# Altium schematic sheet H-00488 - I2C Address.SchDoc: I2C Address Selection
size 403 x 281 mm; DocumentNumber: 4; SheetNumber: 4; SheetTotal: 12
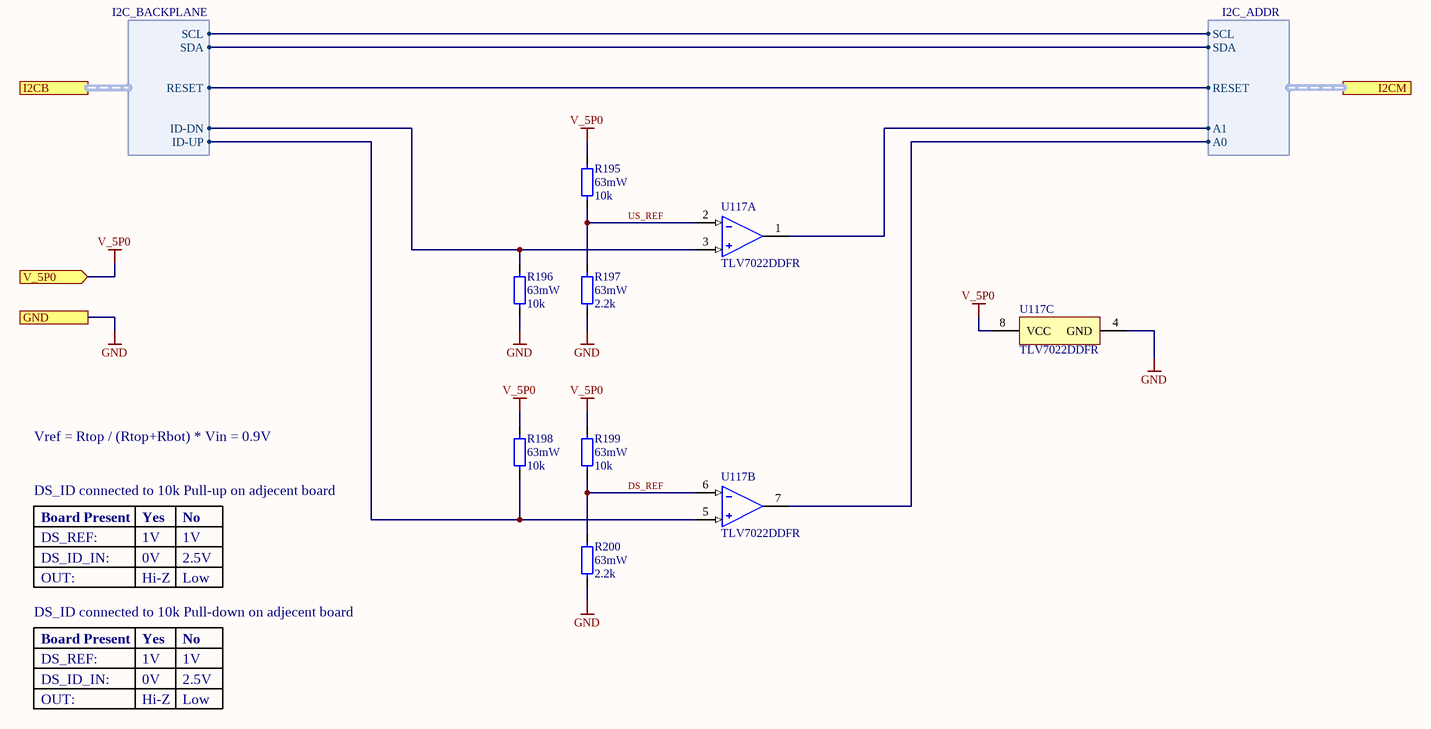
[diagram p0: H-00488 - I2C Address.SchDoc]

## Parts
R195  value 10k  Rated Power: 63mW  [RESC100X50X40L25N]  (hidden comment: CRCW040210K0FKED)
R196  value 10k  Rated Power: 63mW  [RESC100X50X40L25N]  (hidden comment: CRCW040210K0FKED)
R197  value 2.2k  Rated Power: 63mW  [RESC100X50X40L25N]  (hidden comment: CRCW04022K20FKED)
R198  value 10k  Rated Power: 63mW  [RESC100X50X40L25N]  (hidden comment: CRCW040210K0FKED)
R199  value 10k  Rated Power: 63mW  [RESC100X50X40L25N]  (hidden comment: CRCW040210K0FKED)
R200  value 2.2k  Rated Power: 63mW  [RESC100X50X40L25N]  (hidden comment: CRCW04022K20FKED)
U117  TLV7022DDFR  [SOT23-8P65_280X110L45X30]  (parts A,B,C of 3)

## Ports
GND, I2CB (harness I2C_BACKPLANE), I2CM (harness I2C_ADDR), V_5P0 (in)

## Harnesses
I2C_BACKPLANE: SDA, SCL, ID-UP, RESET, ID-DN
I2C_ADDR: SDA, SCL, A0, A1, RESET

## Nets
GND: R196.1 R197.1 R200.1 U117.4(GND) ; port GND
V_5P0: R195.2 R198.2 R199.2 U117.8(VCC) ; port V_5P0
DS_REF: R199.1 R200.2 U117.6(IN-)
US_REF: R195.1 R197.2 U117.2(IN-)
NetR196_2: R196.2 U117.3(IN+) ; port I2CB.ID-DN
NetR198_1: R198.1 U117.5(IN+) ; port I2CB.ID-UP
NetU117_1: U117.1(OUT) ; port I2CM.A1
NetU117_7: U117.7(OUT) ; port I2CM.A0
(unnamed): port I2CB.SDA, port I2CM.SDA
(unnamed): port I2CB.SCL, port I2CM.SCL
(unnamed): port I2CB.RESET, port I2CM.RESET

## Notes on the sheet
- Vref = Rtop / (Rtop+Rbot) * Vin = 0.9V
- DS_ID connected to 10k Pull-up on adjecent board
- Board Present
- Yes
- No
- OUT:
- DS_ID_IN:
- DS_REF:
- 0V
- 1V
- Hi-Z
- 2.5V
- Low
- DS_ID connected to 10k Pull-down on adjecent board
- PROJECT
- DESCRIPTION
- SIZE
- ENGINEER
- VARIANT
- A3
- TITLE
- MODIFIED
- RELEASE
- HIBER BV
  MOERMANSKKADE 600
  1013 BC, AMSTERDAM
  THE NETHERLANDS
- FILE NAME
- APPROVER
- SHEET
- APPROVED
- OF
- THIS DOCUMENT AND THE DATA DISCLOSED HEREIN OR HEREWITH IS THE PROPERTY OF HIBER INTERNATIONAL BV. IT CONTAINS CONFIDENTIAL AND PROPRIETARY INFORMATION THAT CANNOT BE REPRODUCED OR DIVULGED, IN WHOLE OR IN PART, WITHOUT WRITTEN AUTHORIZATION.

## Library data of the parts
R195 R196 R198 R199 = CMP-00294-7: RES Standard Thick Film 0402 10K0 ±1% 0,063W; Qualification: Automotive; Rated Voltage: 50V; Mount: Surface Mount; Termination Finish: Pure tin solder contacts on Ni barrier layer; Tolerance: 1%; Type: Standard Thick Film; Case/Package: 0402 (1005); Failure Rate: N/A; Pins: 2; RoHS: Yes
R197 R200 = CMP-00278-8: RES Standard Thick Film 0402 2K20 ±1% 0,063W; Qualification: Automotive; Rated Voltage: 50V; Mount: Surface Mount; Termination Finish: Pure tin solder contacts on Ni barrier layer; Tolerance: 1%; Type: Standard Thick Film; Case/Package: 0402 (1005); Failure Rate: N/A; Pins: 2; RoHS: Yes
U117 = CMP-01129-2: Micropower small size comparator (dual, open-drain output) 8-SOT-23-THIN -40 to 125